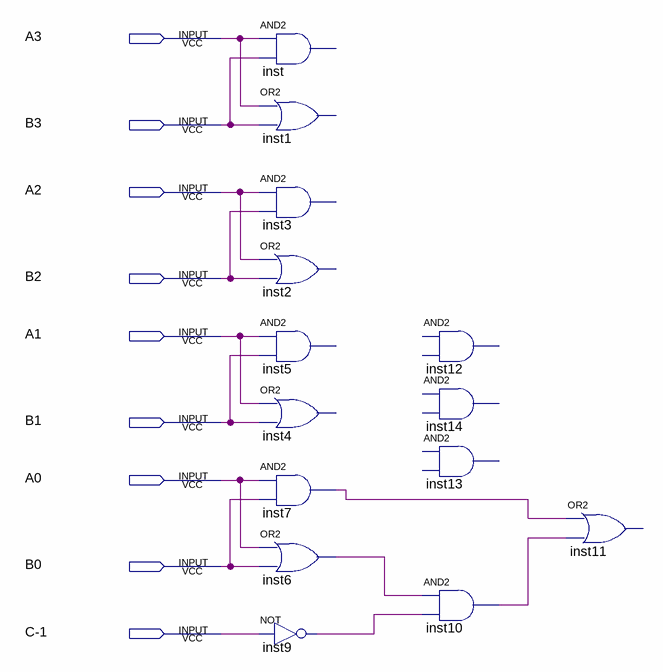
[diagram p0: schematic sheet]
// Quartus schematic ALU4.bdf as structural Verilog: 14 symbols, 9 pins
module ALU4 (
  input  A3,
  input  B3,
  input  A2,
  input  B2,
  input  A1,
  input  B1,
  input  A0,
  input  B0,
  input  \C-1 
);

  wire inst6_out, inst7_out, inst9_out, inst10_out;

  // AND2 inst has open pins: IN1=A3, IN2=B3, OUT=open
  // OR2 inst1 has open pins: IN1=A3, IN2=B3, OUT=open
  // AND2 inst3 has open pins: IN1=A2, IN2=B2, OUT=open
  // OR2 inst2 has open pins: IN1=A2, IN2=B2, OUT=open
  // AND2 inst5 has open pins: IN1=A1, IN2=B1, OUT=open
  // OR2 inst4 has open pins: IN1=A1, IN2=B1, OUT=open
  and inst7 (inst7_out, A0, B0);
  or inst6 (inst6_out, A0, B0);
  not inst9 (inst9_out, \C-1 );
  // AND2 inst12 is placed but not wired
  // AND2 inst14 is placed but not wired
  // AND2 inst13 is placed but not wired
  and inst10 (inst10_out, inst6_out, inst9_out);
  // OR2 inst11 has open pins: IN1=inst7_out, IN2=inst10_out, OUT=open
endmodule
